# Altium schematic sheet Qilin.SchDoc: Qilin焊台原理图
size A4; Date: 2022/4/10; DrawnBy: YLHS; Revision: V0.1; SheetNumber: 1; SheetTotal: 1
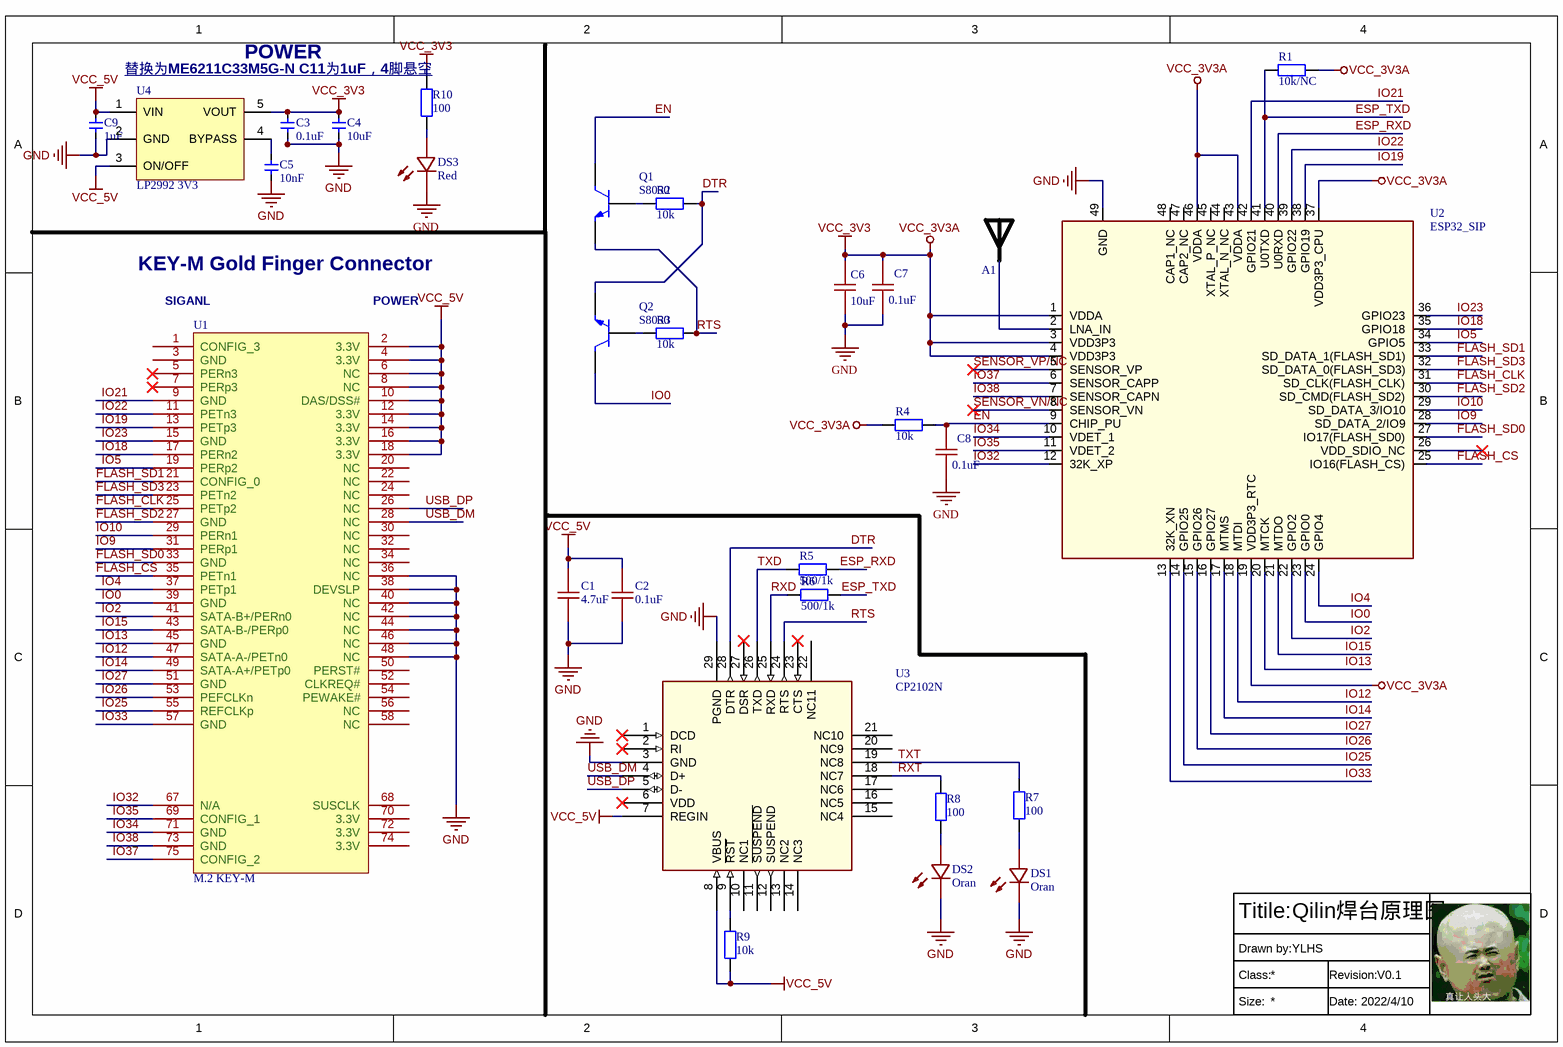
[diagram p0: Qilin.SchDoc]

## Parts
A1  RAINSUN  [ANT-Rainsun-AN5120]  (value not drawn)
C1  4.7uF  [Cap(0402)]
C2  0.1uF  [Cap(0402)]
C3  0.1uF  [CAP_0402]
C4  10uF  [CAP_0402]
C5  10nF  [CAP_0402]
C6  10uF  [Cap(0402)]
C7  0.1uF  [Cap(0402)]
C8  0.1uF  [Cap(0402)]
C9  1uF  [CAP_0402]
DS1  Oran  [LED(0402)]
DS2  Oran  [LED(0402)]
DS3  Red  [LED(0402)]
Q1  S8050  [SOT23-3]
Q2  S8050  [SOT23-3]
R1  value 10k/NC  [Res(0402)]  (hidden comment: 10K)
R2  10K  [Res(0402)]
R3  10K  [Res(0402)]
R4  10K  [Res(0402)]
R5  value 500/1k  [Res(0402)]  (hidden comment: 500R)
R6  value 500/1k  [Res(0402)]  (hidden comment: 500R)
R7  value 100  [Res(0402)]  (hidden comment: 100R)
R8  value 100  [Res(0402)]  (hidden comment: 100R)
R9  10K  [Res(0402)]
R10  value 100  [Res(0402)]  (hidden comment: 100R)
U1  M.2 KEY-M  [M.2]
U2  ESP32_SIP  [QFN-48 7*7]
U3  CP2102N  [CP2102N]
U4  LP2992 3V3  [SOT23-5]

## Nets
GND: C1.1 C2.1 C3.1 C4.1 C5.1 C6.1 C7.1 C8.1 C9.1 DS1.1(C) DS2.1(C) DS3.1(C) U1.36(NC) U1.38(DEVSLP) U1.40(NC) U1.42(NC) U1.44(NC) U1.46(NC) U1.48(NC) U2.49(GND) U3.3(GND) U3.29(PGND) U4.2(GND)
VCC_3V3: C3.2 C4.2 C6.2 C7.2 R1.2 R4.1 R10.2 U2.1(VDDA) U2.3(VDD3P3) U2.4(VDD3P3) U2.19(VDD3P3_RTC) U2.37(VDD3P3_CPU) U2.43(VDDA) U2.46(VDDA) U4.5(VOUT)  [also labelled VCC_3V3A]
VCC_5V: C1.2 C2.2 C9.2 R9.2 U1.2(3.3V) U1.4(3.3V) U1.6(NC) U1.8(NC) U1.10(DAS/DSS#) U1.12(3.3V) U1.14(3.3V) U1.16(3.3V) U1.18(3.3V) U3.7(REGIN) U3.8(VBUS) U4.1(VIN) U4.3(ON/OFF)
DTR: Q2.2(E) R2.2 U3.28(DTR)
EN: C8.2 Q1.3(C) R4.2 U2.9(CHIP_PU)
ESP_RXD: R5.2 U2.40(U0RXD)
ESP_TXD: R1.1 R6.2 U2.41(U0TXD)
FLASH_CLK: U1.25(PETp2) U2.31(SD_CLK(FLASH_CLK))
FLASH_CS: U1.35(PETn1) U2.25(IO16(FLASH_CS))
FLASH_SD0: U1.33(GND) U2.27(IO17(FLASH_SD0))
FLASH_SD1: U1.21(CONFIG_0) U2.33(SD_DATA_1(FLASH_SD1))
FLASH_SD2: U1.27(GND) U2.30(SD_CMD(FLASH_SD2))
FLASH_SD3: U1.23(PETn2) U2.32(SD_DATA_0(FLASH_SD3))
IO0: Q2.3(C) U1.39(GND) U2.23(GPIO0)
IO2: U1.41(SATA-B+/PERn0) U2.22(GPIO2)
IO4: U1.37(PETp1) U2.24(GPIO4)
IO5: U1.19(PERp2) U2.34(GPIO5)
IO9: U1.31(PERp1) U2.28(SD_DATA_2/IO9)
IO10: U1.29(PERn1) U2.29(SD_DATA_3/IO10)
IO12: U1.47(SATA-A-/PETn0) U2.18(MTDI)
IO13: U1.45(GND) U2.20(MTCK)
IO14: U1.49(SATA-A+/PETp0) U2.17(MTMS)
IO15: U1.43(SATA-B-/PERp0) U2.21(MTDO)
IO18: U1.17(PERn2) U2.35(GPIO18)
IO19: U1.13(PETp3) U2.38(GPIO19)
IO21: U1.9(GND) U2.42(GPIO21)
IO22: U1.11(PETn3) U2.39(GPIO22)
IO23: U1.15(GND) U2.36(GPIO23)
IO25: U1.55(REFCLKp) U2.14(GPIO25)
IO26: U1.53(PEFCLKn) U2.15(GPIO26)
IO27: U1.51(GND) U2.16(GPIO27)
IO32: U1.67(N/A) U2.12(32K_XP)
IO33: U1.57(GND) U2.13(32K_XN)
IO34: U1.71(GND) U2.10(VDET_1)
IO35: U1.69(CONFIG_1) U2.11(VDET_2)
IO37: U1.75(CONFIG_2) U2.6(SENSOR_CAPP)
IO38: U1.73(GND) U2.7(SENSOR_CAPN)
RTS: Q1.2(E) R3.2 U3.24(RTS)
RXD: R6.1 U3.25(RXD)
RXT: R8.2 U3.18(NC7)
SENSOR_VN/NC: U2.8(SENSOR_VN)
SENSOR_VP/NC: U2.5(SENSOR_VP)
TXD: R5.1 U3.26(TXD)
TXT: R7.2 U3.19(NC8)
USB_DM: U1.28(NC) U3.4(D+)
USB_DP: U1.26(NC) U3.5(D-)
NetA1_1: A1.1 U2.2(LNA_IN)
NetC5_2: C5.2 U4.4(BYPASS)
NetDS1_2: DS1.2(A) R7.1
NetDS2_2: DS2.2(A) R8.1
NetDS3_2: DS3.2(A) R10.1
NetQ1_1: Q1.1(B) R2.1
NetQ2_1: Q2.1(B) R3.1
NetR9_1: R9.1 U3.9(~{RST})

Not connected (* = marked no-connect by the designer): U1 1(CONFIG_3) 3(GND) 5(PERn3)* 7(PERp3)* 20(NC) 22(NC) 24(NC) 30(NC) 32(NC) 34(NC) 50(PERST#) 52(CLKREQ#) 54(PEWAKE#) 56(NC) 58(NC) 68(SUSCLK) 70(3.3V) 72(3.3V) 74(3.3V); U2 26(VDD_SDIO_NC)* 44(XTAL_N_NC) 45(XTAL_P_NC) 47(CAP2_NC) 48(CAP1_NC); U3 1(DCD)* 2(RI)* 6(VDD)* 10(NC1) 11(~{SUSPEND}) 12(SUSPEND) 13(NC2) 14(NC3) 15(NC4) 16(NC5) 17(NC6) 20(NC9) 21(NC10) 22(NC11) 23(CTS)* 27(DSR)*

## Notes on the sheet
- 替换为ME6211C33M5G-N C11为1uF，4脚悬空 <https://item.taobao.com/item.htm?spm=a1z10.3-c-s.w4002-21223910208.12.14076a4b6jT4Yt&id=572750408153>
- POWER
- KEY-M Gold Finger Connector
- (near U1) SIGANL
- (near U1) POWER
- Titile:
- Drawn by:
- Class:
- Revision:
- Size:
- Date:

## Library data of the parts
A1 = ANT-Rainsun-AP5120
C1 C2 C6-C8 = Cap(0402): 贴片电容0402
  C1: Value: 4.7uF
  C2 C7 C8: Value: 0.1uF
  C6: Value: 10uF
C3-C5 C9 = 电容-0402: Capacitor; Value: 0.1u
DS1 DS2 = LED_Orange
DS3 = LED_Red
Q1 Q2 = S8050: NPN
R1-R10 = Res(0402)
  R2-R4 R9: Value: 10k
U1 = M.2 KEY-M: NGFF M.2 KEY-M
U2 = ESP32-PICO-D4
U3 = CP2102N: USB转串口
U4 = LP2992: LDO